# Altium project general-schematics.PrjPCB (part 1 of 2)
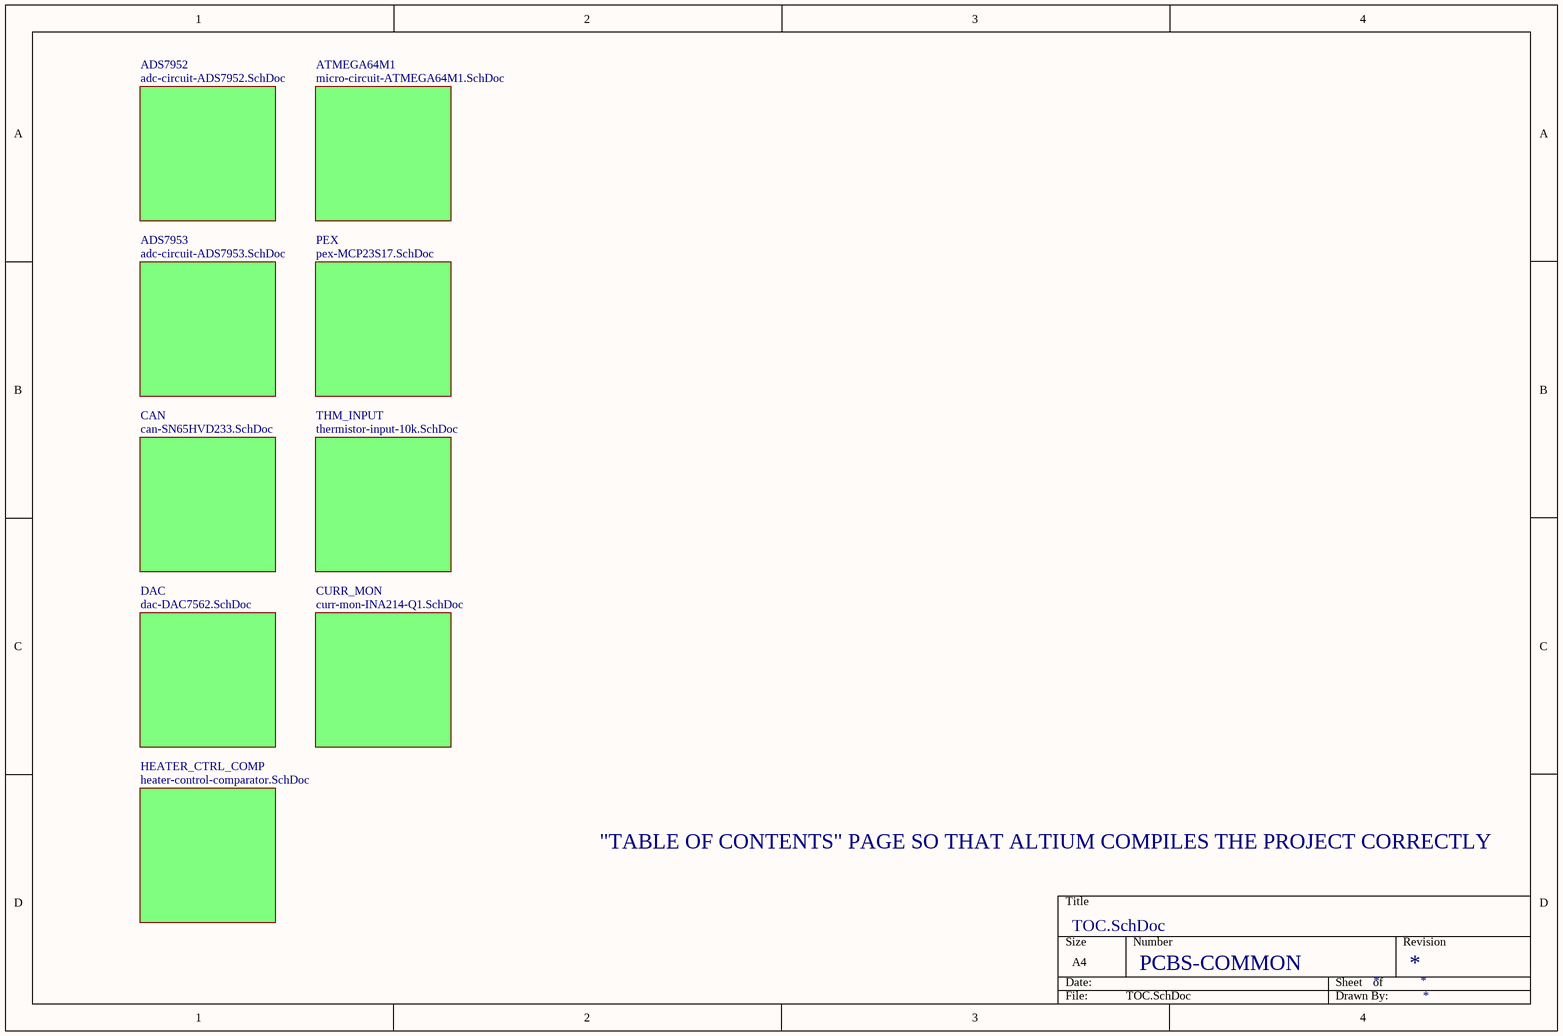
[diagram p0: TOC.SchDoc]
14 sheets, 103 parts. Net scope: hierarchical (ports join the sheet entries above them; power ports are global).
Sheets:
  TOC.SchDoc
    ADS7952 = adc-circuit-ADS7952.SchDoc
      ADS7952 = adc-ADS7952.SchDoc
    ADS7953 = adc-circuit-ADS7953.SchDoc
      ADS7953 = adc-ADS7953.SchDoc
    CAN = can-SN65HVD233.SchDoc
    DAC = dac-DAC7562.SchDoc
    HEATER_CTRL_COMP = heater-control-comparator.SchDoc
    ATMEGA64M1 = micro-circuit-ATMEGA64M1.SchDoc
      micro-circuit- = led-monitoring-SN74HC365PW.SchDoc
      ATMEGA64M1 = micro-ATMEGA64M1.SchDoc
    PEX = pex-MCP23S17.SchDoc
    THM_INPUT = thermistor-input-10k.SchDoc
    CURR_MON = curr-mon-INA214-Q1.SchDoc

## Sheet TOC.SchDoc
size A4

### Sub-sheets
ADS7952 = adc-circuit-ADS7952.SchDoc: no entries
ADS7953 = adc-circuit-ADS7953.SchDoc: no entries
ATMEGA64M1 = micro-circuit-ATMEGA64M1.SchDoc: no entries
CAN = can-SN65HVD233.SchDoc: no entries
CURR_MON = curr-mon-INA214-Q1.SchDoc: no entries
DAC = dac-DAC7562.SchDoc: no entries
HEATER_CTRL_COMP = heater-control-comparator.SchDoc: no entries
PEX = pex-MCP23S17.SchDoc: no entries
THM_INPUT = thermistor-input-10k.SchDoc: no entries

### Notes on the sheet
- "TABLE OF CONTENTS" PAGE SO THAT ALTIUM COMPILES THE PROJECT CORRECTLY
- PCBS-COMMON

## Sheet adc-circuit-ADS7952.SchDoc: ADS7952 Circuit
size A4; DrawnBy: Dylan Vogel; Organization: UTAT SS; Revision: 1.1
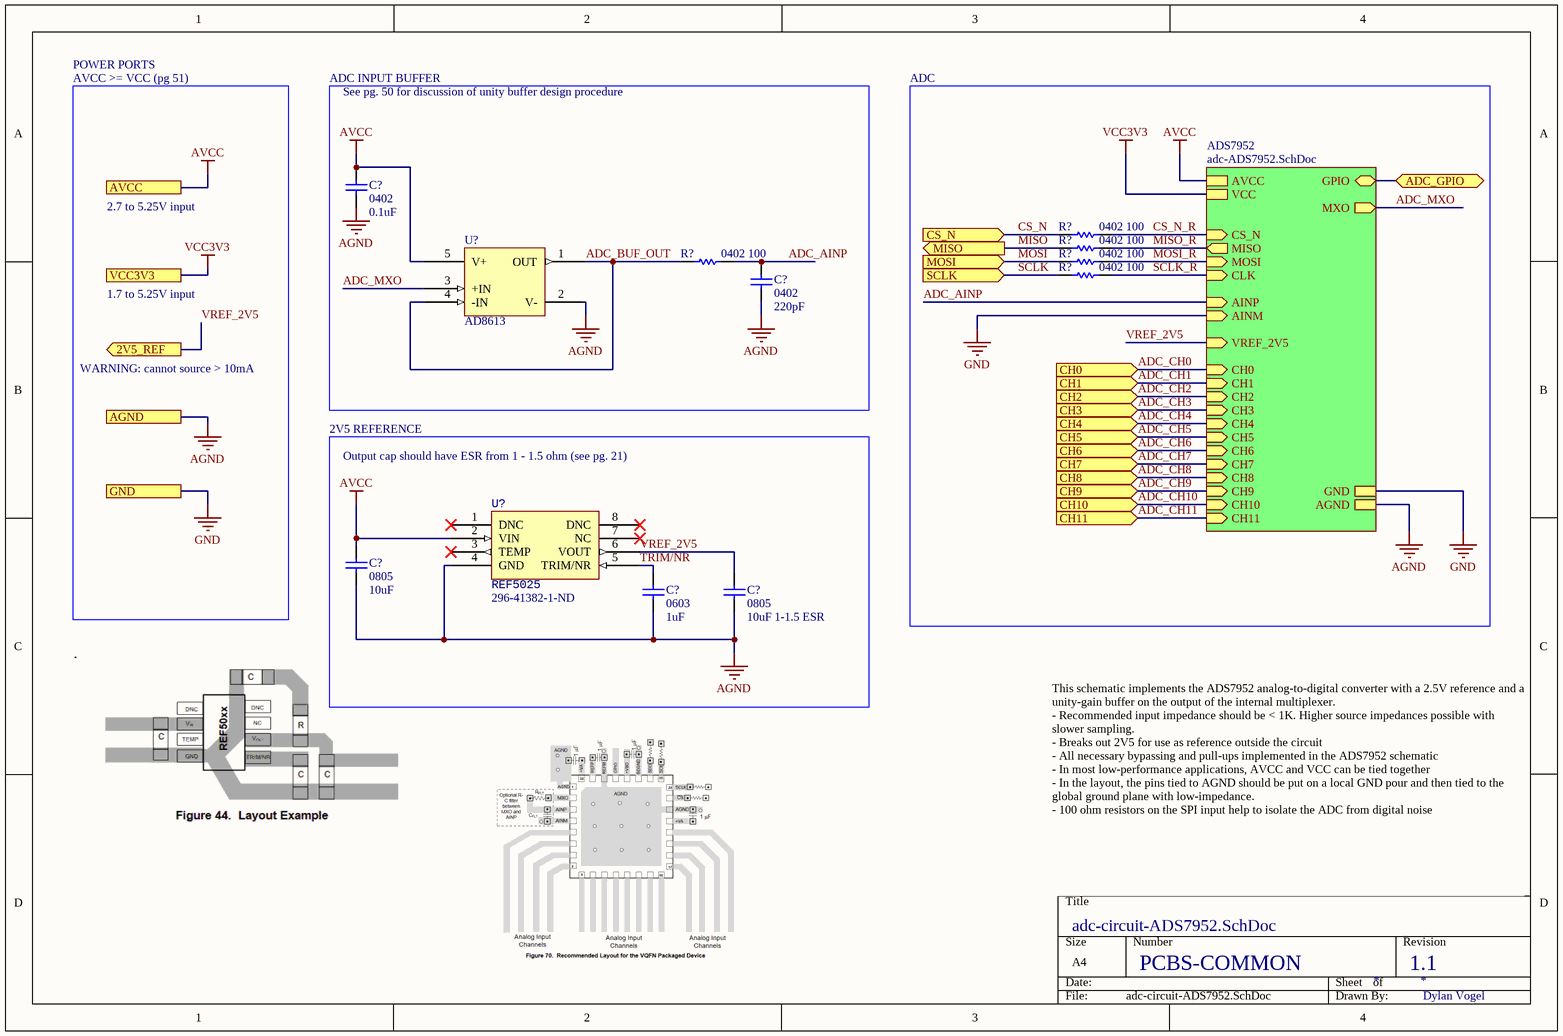
[diagram p1: adc-circuit-ADS7952.SchDoc]

### Parts
(Parts that share a designator on the sheet are numbered #1, #2 ... from top to bottom, then left to right.)
C?#1  0402  value 0.1uF  [CAP0402R]
C?#2  0402  value 220pF  [CAP0402R]
C?#3  0805  value 10uF  [CAP0805R]
C?#4  0603  value 1uF  [CAP0603R]
C?#5  0805  value 10uF 1-1.5 ESR  [CAP0805R]
R?#1  0402  value 100  [RES0402R]
R?#2  0402  value 100  [RES0402R]
R?#3  0402  value 100  [RES0402R]
R?#4  0402  value 100  [RES0402R]
R?#5  0402  value 100  [RES0402R]
U?#1  AD8613  [SOP65P200X125-5N]
U?#2  REF5025  Supplier Part Number 1: 296-41382-1-ND  [SOP65P300X125-8N]

### Blocks framed on the sheet
ADC: R?#1 R?#2 R?#4 R?#5

### Sub-sheets
ADS7952 = adc-ADS7952.SchDoc: CH8 (in), CH2 (in), CH11 (in), CH10 (in), CH9 (in), CH6 (in), CH3 (in), CH7 (in), CH5 (in), CH4 (in), CH0 (in), CH1 (in), AVCC, GND, VCC, AGND, CLK (in), MISO (out), MOSI (in), CS_N (in), GPIO (bidir), AINP (in), VREF_2V5 (in), MXO (out), AINM (in)  | C1: =C6; C2: =C7; C3: =C8; C4: =C9; R1: =R6

### Ports
2V5_REF (out), ADC_GPIO (bidir), AGND, AVCC, CH0 (in), CH1 (in), CH2 (in), CH3 (in), CH4 (in), CH5 (in), CH6 (in), CH7 (in), CH8 (in), CH9 (in), CH10 (in), CH11 (in), CS_N (in), GND, MISO (out), MOSI (in), SCLK (in), VCC3V3

### Nets
AGND: C?#1.1 C?#2.1 C?#3.1 C?#4.1 C?#5.1 U?#1.2(V-) U?#2.4(GND) ; port AGND, sheet ADS7952/AGND
AVCC: C?#1.2 C?#3.2 U?#1.5(V+) U?#2.2(VIN) ; port AVCC, sheet ADS7952/AVCC
GND: port GND, sheet ADS7952/GND, sheet ADS7952/AINM
VCC3V3: port VCC3V3, sheet ADS7952/VCC  [project net VCC]
ADC_AINP: C?#2.2 R?#3.2 ; sheet ADS7952/AINP
ADC_BUF_OUT: R?#3.1 U?#1.1(OUT) U?#1.4(-IN)
ADC_CH0: port CH0, sheet ADS7952/CH0
ADC_CH1: port CH1, sheet ADS7952/CH1
ADC_CH2: port CH2, sheet ADS7952/CH2
ADC_CH3: port CH3, sheet ADS7952/CH3
ADC_CH4: port CH4, sheet ADS7952/CH4
ADC_CH5: port CH5, sheet ADS7952/CH5
ADC_CH6: port CH6, sheet ADS7952/CH6
ADC_CH7: port CH7, sheet ADS7952/CH7
ADC_CH8: port CH8, sheet ADS7952/CH8
ADC_CH9: port CH9, sheet ADS7952/CH9
ADC_CH10: port CH10, sheet ADS7952/CH10
ADC_CH11: port CH11, sheet ADS7952/CH11
ADC_MXO: U?#1.3(+IN) ; sheet ADS7952/MXO
CS_N: R?#1.1 ; port CS_N
CS_N_R: R?#1.2 ; sheet ADS7952/CS_N
GPIO: port ADC_GPIO, sheet ADS7952/GPIO
MISO: R?#2.1 ; port MISO
MISO_R: R?#2.2 ; sheet ADS7952/MISO
MOSI: R?#4.1 ; port MOSI
MOSI_R: R?#4.2 ; sheet ADS7952/MOSI
SCLK: R?#5.1 ; port SCLK
SCLK_R: R?#5.2 ; sheet ADS7952/CLK
TRIM/NR: C?#4.2 U?#2.5(TRIM/NR)
VREF_2V5: C?#5.2 U?#2.6(VOUT) ; port 2V5_REF, sheet ADS7952/VREF_2V5

Not connected (* = marked no-connect by the designer): U?#2 1(DNC)* 3(TEMP)* 7(NC)* 8(DNC)*

### Notes on the sheet
- POWER PORTS
- AVCC >= VCC (pg 51)
- ADC INPUT BUFFER
- See pg. 50 for discussion of unity buffer design procedure
- 2.7 to 5.25V input
- 1.7 to 5.25V input
- WARNING: cannot source > 10mA
- 2V5 REFERENCE
- Output cap should have ESR from 1 - 1.5 ohm (see pg. 21)
- This schematic implements the ADS7952 analog-to-digital converter with a 2.5V reference and a unity-gain buffer on the output of the internal multiplexer.
  - Recommended input impedance should be < 1K. Higher source impedances possible with slower sampling.
  - Breaks out 2V5 for use as reference outside the circuit
  - All necessary bypassing and pull-ups implemented in the ADS7952 schematic
  - In most low-performance applications, AVCC and VCC can be tied together
  - In the layout, the pins tied to AGND should be put on a local GND pour and then tied to the global ground plane with low-impedance.
  - 100 ohm resistors on the SPI input help to isolate the ADC from digital noise
- PCBS-COMMON

### Library data of the parts
C?#1 = CAP0402: 0402 capacitor; Manufacturer: Taiyo Yuden; Manufacturer Part Number: EMK105B7104KVHF; Voltage Rating: 16V; Capacitance: 100nF; Tolerance: 10%; Dielectric: X7R; Supplier 1: Digi-Key; Supplier Part Number 1: 587-3807-1-ND; Stock 1: 18196; Pricing 1: 1=0.1, 10=0.057, 100=0.0254, 500=0.01812, 1000=0.01423, 2500=0.01294, 5000=0.0119 (USD); Mount: Surface Mount; Case/Package: 0402; Weight: 2.3E-05oz; Case Code (Metric): 1005; Case Code (Imperial): 0402; Min Operating Temperature: -55°C; Max Operating Temperature: 125°C; Package Quantity: 10000; Packaging: Tape and Reel; Termination: SMD/SMT; Voltage Rating (DC): 16V; Length: 0.039inch; Height: 0.5mm; Width: 0.02inch; Thickness: 0.022inch; Ratings: AEC-Q200; Lead Free: Lead Free; Halogen Free: Halogen Free
C?#2 = CAP0402: 0402 capacitor; Manufacturer: Murata; Manufacturer Part Number: GCM155R71H221KA37D; Tolerance: 10%; Voltage Rating: 50V; Dielectric: X7R; Supplier 1: Digi-Key; Supplier Part Number 1: 490-4912-1-ND; Stock 1: 141569; Pricing 1: 1=0.1, 10=0.059, 100=0.0264, 500=0.01884, 1000=0.0148, 2500=0.01346, 5000=0.01238 (USD); Mount: Surface Mount; Case/Package: 0402; Case Code (Imperial): 0402; Case Code (Metric): 1005; Min Operating Temperature: -55°C; Max Operating Temperature: 125°C; Capacitance: 220pF; Package Quantity: 1; Packaging: Tape and Reel; Termination: SMD/SMT; Voltage: 50V; Voltage Rating (DC): 50V; Length: 1mm; Height: 0.5mm; Width: 0.02inch; Thickness: 0.022inch; Depth: 0.5mm; Ratings: AEC-Q200; Radiation Hardening: No; ComponentLink1URL: http://psearch.murata.com/capacitor/product/GCM155R71H221KA37%23.pdf?src-supplier=Avnet+Europe; ComponentLink1Description: http://psearch.murata.com/capacitor/product/GCM155R71H221KA37%23.pdf?src-supplier=Avnet+Europe; ComponentLink2URL: http://search.murata.co.jp/Ceramy/image/img/A01X/partnumbering_e_02.pdf?src-supplier=Digi-Key; ComponentLink2Description: http://search.murata.co.jp/Ceramy/image/img/A01X/partnumbering_e_02.pdf?src-supplier=Digi-Key; ComponentLink3URL: https://www.murata.com/~/media/webrenewal/support/library/catalog/products/capacitor/mlcc/c03e.ashx?src-supplier=Avnet; ComponentLink3Description: https://www.murata.com/~/media/webrenewal/support/library/catalog/products/capacitor/mlcc/c03e.ashx?src-supplier=Avnet
C?#3 = CAP0805: 0805 capacitor; Manufacturer: Murata; Manufacturer Part Number: GCM21BR70J106KE22K; Tolerance: 10%; Dielectric: X7R; Voltage Rating (DC): 6.3V; Supplier 1: Digi-Key; Supplier Part Number 1: 490-14361-1-ND; Stock 1: 214938; Pricing 1: 1=0.42, 10=0.29, 100=0.1742, 500=0.13064, 1000=0.11031, 2500=0.10451, 5000=0.0987 (USD); Case/Package: 0805; Min Operating Temperature: -55°C; Max Operating Temperature: 125°C; Capacitance: 10uF; Packaging: Tape and Reel; Length: 2mm; Depth: 1.25mm; Lead Free: Lead Free
C?#4 = CAP0603: 0603 capacitor; Manufacturer: KEMET; Manufacturer Part Number: C0603C105K4RACAUTO; Tolerance: 10%; Voltage Rating: 16V; Supplier 1: Digi-Key; Supplier Part Number 1: 399-17704-1-ND; Stock 1: 376276; Pricing 1: 1=0.17, 10=0.12, 100=0.0564, 500=0.03952, 1000=0.03273 (USD); Mount: Surface Mount; Case/Package: 0603; Case Code (Imperial): 0603; Case Code (Metric): 1608; Min Operating Temperature: -55°C; Max Operating Temperature: 125°C; Packaging: Cut Tape; Capacitance: 1uF; Ratings: AEC-Q200
C?#5 = CAP0805: 0805 capacitor; Manufacturer: Murata; Manufacturer Part Number: GCM21BR70J106KE22K; Capacitance: 10uF; Tolerance: 10%; Dielectric: X7R; Voltage Rating (DC): 6.3V; Supplier 1: Digi-Key; Supplier Part Number 1: 490-14361-1-ND; Stock 1: 214938; Pricing 1: 1=0.42, 10=0.29, 100=0.1742, 500=0.13064, 1000=0.11031, 2500=0.10451, 5000=0.0987 (USD); Case/Package: 0805; Min Operating Temperature: -55°C; Max Operating Temperature: 125°C; Packaging: Tape and Reel; Length: 2mm; Depth: 1.25mm; Lead Free: Lead Free
R?#1-R?#5 = RES0402: 0402 resistor; Manufacturer: Vishay Dale; Manufacturer Part Number: CRCW0402100RFKEDHP; Resistance: 100R; Tolerance: 1%; Power Rating: 125mW; Voltage Rating: 50V; Temperature Coefficient: 100ppm/°C; Supplier 1: Digi-Key; Supplier Part Number 1: 541-100YCT-ND; Stock 1: 530594; Pricing 1: 1=0.15, 10=0.138, 100=0.0532, 1000=0.02343, 2500=0.02023, 5000=0.0181 (USD); Mount: Surface Mount; Case/Package: 0402; Weight: 2.3E-05oz; Case Code (Imperial): 0402; Case Code (Metric): 1005; Contact Plating: Tin; Min Operating Temperature: -55°C; Max Operating Temperature: 155°C; Packaging: Tape and Reel; Package Quantity: 10000; Termination: SMD/SMT; Composition: Thick Film; Voltage Rating (DC): 50V; Length: 1mm; Height: 0.3mm; Width: 0.5mm; Depth: 0.5mm; Radiation Hardening: No; REACH SVHC: Unknown; Lead Free: Lead Free; ComponentLink1URL: http://www.vishay.com/docs/20043/crcwhpe3.pdf?src-supplier=Avnet; ComponentLink1Description: http://www.vishay.com/docs/20043/crcwhpe3.pdf?src-supplier=Avnet
U?#1 = AD8613: Low power, low noise rail-to-rail op-amp.; Supplier 1: Digi-Key; Supplier Part Number 1: AD8613AKSZ-REEL7CT-ND
U?#2 = REF5025: Voltage Reference; Supplier 1: Digi-Key

## Sheet adc-ADS7952.SchDoc: ADS7952
size A4; DrawnBy: Dylan Vogel; Organization: UTAT SS; Revision: 1.1
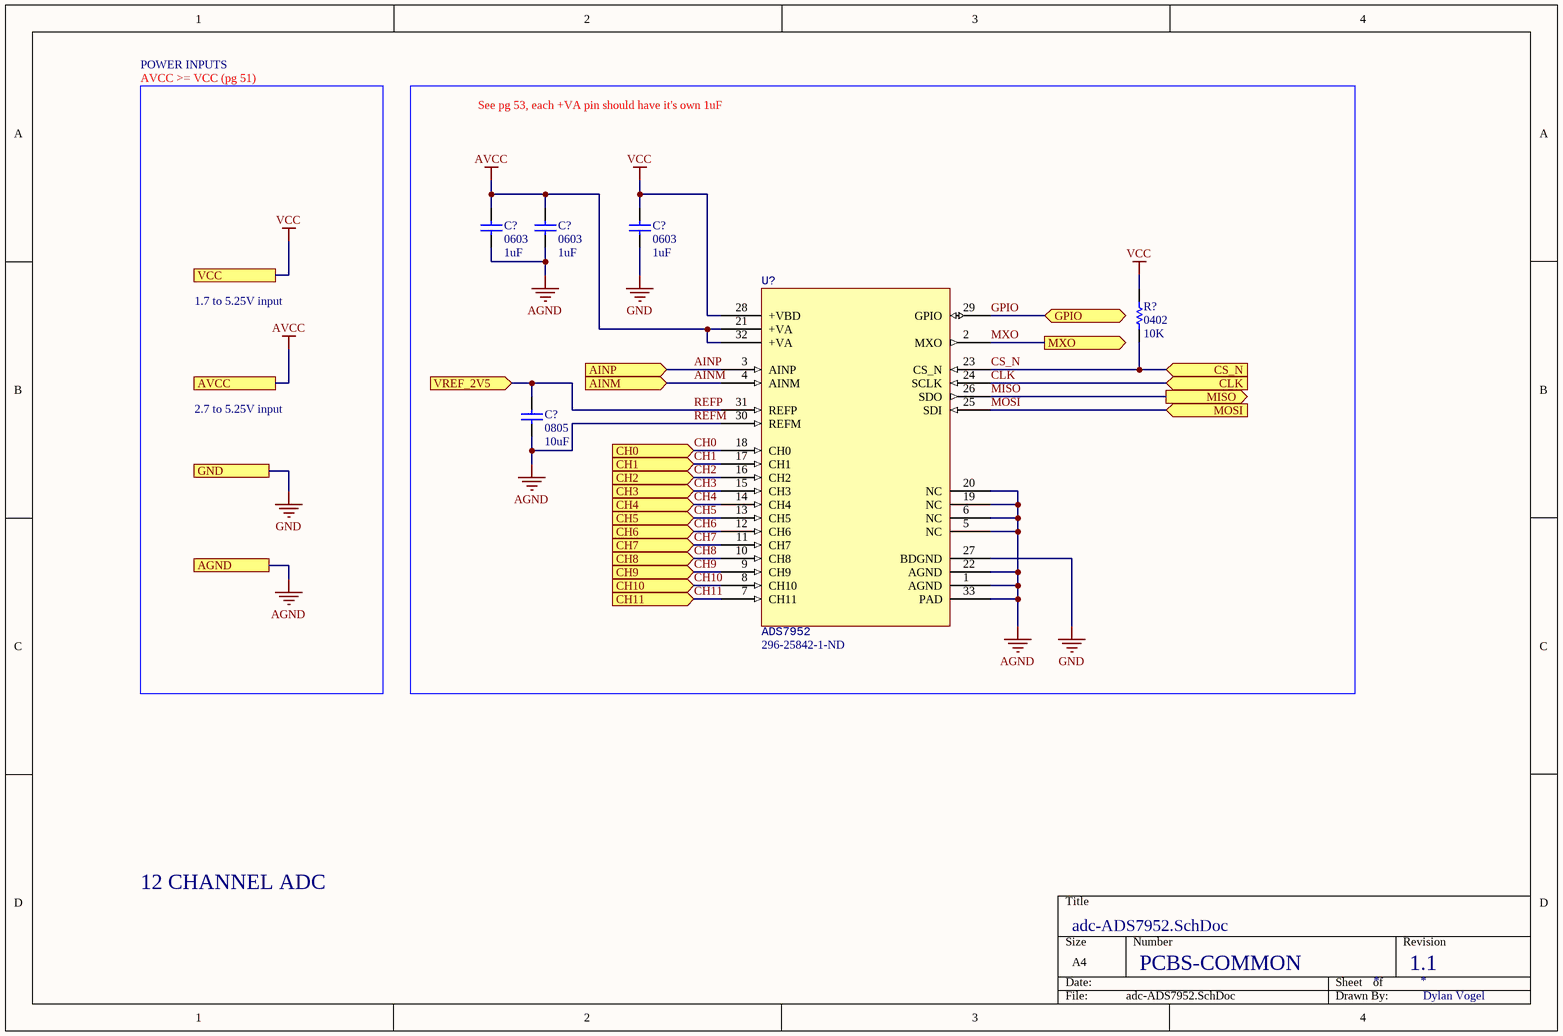
[diagram p2: adc-ADS7952.SchDoc]

### Parts
(Parts that share a designator on the sheet are numbered #1, #2 ... from top to bottom, then left to right.)
C?#6  0603  value 1uF  [CAP0603R]
C?#7  0603  value 1uF  [CAP0603R]
C?#8  0603  value 1uF  [CAP0603R]
C?#9  0805  value 10uF  [CAP0805R]
R?#6  0402  value 10K  [RES0402R]
U?#3  ADS7952  Supplier Part Number 1: 296-25842-1-ND  [QFN50P500X500X100-33]

### Blocks framed on the sheet
See pg 53, each +VA pin should have it's own 1uF: C?#6-C?#9 R?#6 U?#3

### Ports
AGND, AINM (in), AINP (in), AVCC, CH0 (in), CH1 (in), CH2 (in), CH3 (in), CH4 (in), CH5 (in), CH6 (in), CH7 (in), CH8 (in), CH9 (in), CH10 (in), CH11 (in), CLK (in), CS_N (in), GND, GPIO (bidir), MISO (out), MOSI (in), MXO (out), VCC, VREF_2V5 (in)

### Nets
AGND: C?#6.1 C?#7.1 C?#9.1 U?#3.1(AGND) U?#3.5(NC) U?#3.6(NC) U?#3.19(NC) U?#3.20(NC) U?#3.22(AGND) U?#3.30(REFM) U?#3.33(PAD) ; port AGND  [also labelled REFM]
AVCC: C?#6.2 C?#7.2 U?#3.21(+VA) U?#3.32(+VA) ; port AVCC
GND: C?#8.1 U?#3.4(AINM) U?#3.27(BDGND) ; port GND, port AINM  [also labelled AINM]
VCC: C?#8.2 R?#6.2 U?#3.28(+VBD) ; port VCC
AINP: U?#3.3(AINP) ; port AINP  [project net ADC_AINP]
CH0: U?#3.18(CH0) ; port CH0  [project net ADC_CH0]
CH1: U?#3.17(CH1) ; port CH1  [project net ADC_CH1]
CH2: U?#3.16(CH2) ; port CH2  [project net ADC_CH2]
CH3: U?#3.15(CH3) ; port CH3  [project net ADC_CH3]
CH4: U?#3.14(CH4) ; port CH4  [project net ADC_CH4]
CH5: U?#3.13(CH5) ; port CH5  [project net ADC_CH5]
CH6: U?#3.12(CH6) ; port CH6  [project net ADC_CH6]
CH7: U?#3.11(CH7) ; port CH7  [project net ADC_CH7]
CH8: U?#3.10(CH8) ; port CH8  [project net ADC_CH8]
CH9: U?#3.9(CH9) ; port CH9  [project net ADC_CH9]
CH10: U?#3.8(CH10) ; port CH10  [project net ADC_CH10]
CH11: U?#3.7(CH11) ; port CH11  [project net ADC_CH11]
CLK: U?#3.24(SCLK) ; port CLK  [project net SCLK_R]
CS_N: R?#6.1 U?#3.23(CS_N) ; port CS_N  [project net CS_N_R]
GPIO: U?#3.29(GPIO) ; port GPIO
MISO: U?#3.26(SDO) ; port MISO  [project net MISO_R]
MOSI: U?#3.25(SDI) ; port MOSI  [project net MOSI_R]
MXO: U?#3.2(MXO) ; port MXO  [project net ADC_MXO]
REFP: C?#9.2 U?#3.31(REFP) ; port VREF_2V5  [project net VREF_2V5]

### Notes on the sheet
- POWER INPUTS
- AVCC >= VCC (pg 51)
- 1.7 to 5.25V input
- 2.7 to 5.25V input
- 12 CHANNEL ADC
- PCBS-COMMON

### Library data of the parts
C?#6-C?#8 = CAP0603: 0603 capacitor; Manufacturer: KEMET; Manufacturer Part Number: C0603C105K4RACAUTO; Description: CAP CER 0603 1UF 16V X7R 10%; Tolerance: 10%; Voltage Rating: 16V; Supplier 1: Digi-Key; Supplier Part Number 1: 399-17704-1-ND; Stock 1: 376276; Pricing 1: 1=0.17, 10=0.12, 100=0.0564, 500=0.03952, 1000=0.03273 (USD); Mount: Surface Mount; Case/Package: 0603; Case Code (Imperial): 0603; Case Code (Metric): 1608; Min Operating Temperature: -55°C; Max Operating Temperature: 125°C; Packaging: Cut Tape; Capacitance: 1uF; Ratings: AEC-Q200
C?#9 = CAP0805: 0805 capacitor; Manufacturer: Murata; Manufacturer Part Number: GCM21BR70J106KE22K; Description: Cap Ceramic 10uF 6.3V X7R 10% SMD 0805 125C Embossed T/R; Tolerance: 10%; Dielectric: X7R; Voltage Rating (DC): 6.3V; Supplier 1: Digi-Key; Supplier Part Number 1: 490-14361-1-ND; Stock 1: 214938; Pricing 1: 1=0.42, 10=0.29, 100=0.1742, 500=0.13064, 1000=0.11031, 2500=0.10451, 5000=0.0987 (USD); Case/Package: 0805; Min Operating Temperature: -55°C; Max Operating Temperature: 125°C; Capacitance: 10uF; Packaging: Tape and Reel; Length: 2mm; Depth: 1.25mm; Lead Free: Lead Free
R?#6 = RES0402: 0402 resistor; Manufacturer: Panasonic; Manufacturer Part Number: ERJ-2RKF1002X; Description: RES SMD 10K OHM 1% 1/10W 0402; Resistance: 10kR; Power Rating: 100mW; Tolerance: 1%; Voltage Rating: 50V; Temperature Coefficient: 100ppm/°C; Supplier 1: Digi-Key; Supplier Part Number 1: P10.0KLCT-ND; Stock 1: 14350001; Pricing 1: 1=0.1, 10=0.045, 100=0.0183, 1000=0.00823, 2500=0.00715, 5000=0.0059 (USD); Mount: Surface Mount; Case/Package: 0402; Number of Pins: 2; Case Code (Metric): 1005; Case Code (Imperial): 0402; Contact Plating: Tin; Min Operating Temperature: -55°C; Max Operating Temperature: 155°C; Packaging: Tape and Reel; Package Quantity: 1; Composition: Thick Film; Number of Terminations: 2; Termination: SMD/SMT; Military Standard: Not; Max Power Dissipation: 100mW; Voltage Rating (DC): 50V; Features: Automotive AEC-Q200; Length: 1mm; Height: 0.35mm; Width: 0.02inch; Depth: 0.5mm; Radiation Hardening: No; REACH SVHC: No SVHC; Lead Free: Lead Free; ComponentLink1URL: http://industrial.panasonic.com/www-data/pdf/AOA0000/AOA0000CE2.pdf?src-supplier=Future+Electronics; ComponentLink1Description: http://industrial.panasonic.com/www-data/pdf/AOA0000/AOA0000CE2.pdf?src-supplier=Future+Electronics; ComponentLink2URL: http://industrial.panasonic.com/www-data/pdf/AOA0000/AOA0000CE2.pdf?src-supplier=Avnet+Europe; ComponentLink2Description: http://industrial.panasonic.com/www-data/pdf/AOA0000/AOA0000CE2.pdf?src-supplier=Avnet+Europe; ComponentLink3URL: https://industrial.panasonic.com/cdbs/www-data/pdf/RDA0000/DMA0000COL11.pdf?src-supplier=Mouser; ComponentLink3Description: https://industrial.panasonic.com/cdbs/www-data/pdf/RDA0000/DMA0000COL11.pdf?src-supplier=Mouser; ComponentLink4URL: http://www.farnell.com/datasheets/1678782.pdf?src-supplier=Element14; ComponentLink4Description: http://www.farnell.com/datasheets/1678782.pdf?src-supplier=Element14; ComponentLink5URL: http://www.farnell.com/datasheets/1911175.pdf?src-supplier=Farnell; ComponentLink5Description: http://www.farnell.com/datasheets/1911175.pdf?src-supplier=Farnell; ComponentLink6URL: http://www.jameco.com/Jameco/Products/ProdDS/1987020.pdf?src-supplier=Jameco; ComponentLink6Description: http://www.jameco.com/Jameco/Products/ProdDS/1987020.pdf?src-supplier=Jameco; ComponentLink7URL: http://industrial.panasonic.com/www-data/pdf/AOA0000/AOA0000CE2.pdf?src-supplier=Avnet; ComponentLink7Description: http://industrial.panasonic.com/www-data/pdf/AOA0000/AOA0000CE2.pdf?src-supplier=Avnet; ComponentLink8URL: http://www.alliedelec.com/m/d/623f45ff1957d936ff56d46fd1c28cac.pdf?src-supplier=Allied+Electronics; ComponentLink8Description: http://www.alliedelec.com/m/d/623f45ff1957d936ff56d46fd1c28cac.pdf?src-supplier=Allied+Electronics
U?#3 = ADS7952: 12 bit, 12 channel analog-to-digital converter with SPI interface.; Supplier 1: Digi-Key

## Sheet adc-circuit-ADS7953.SchDoc
size A4; DrawnBy: Dylan Vogel; Revision: 1.1
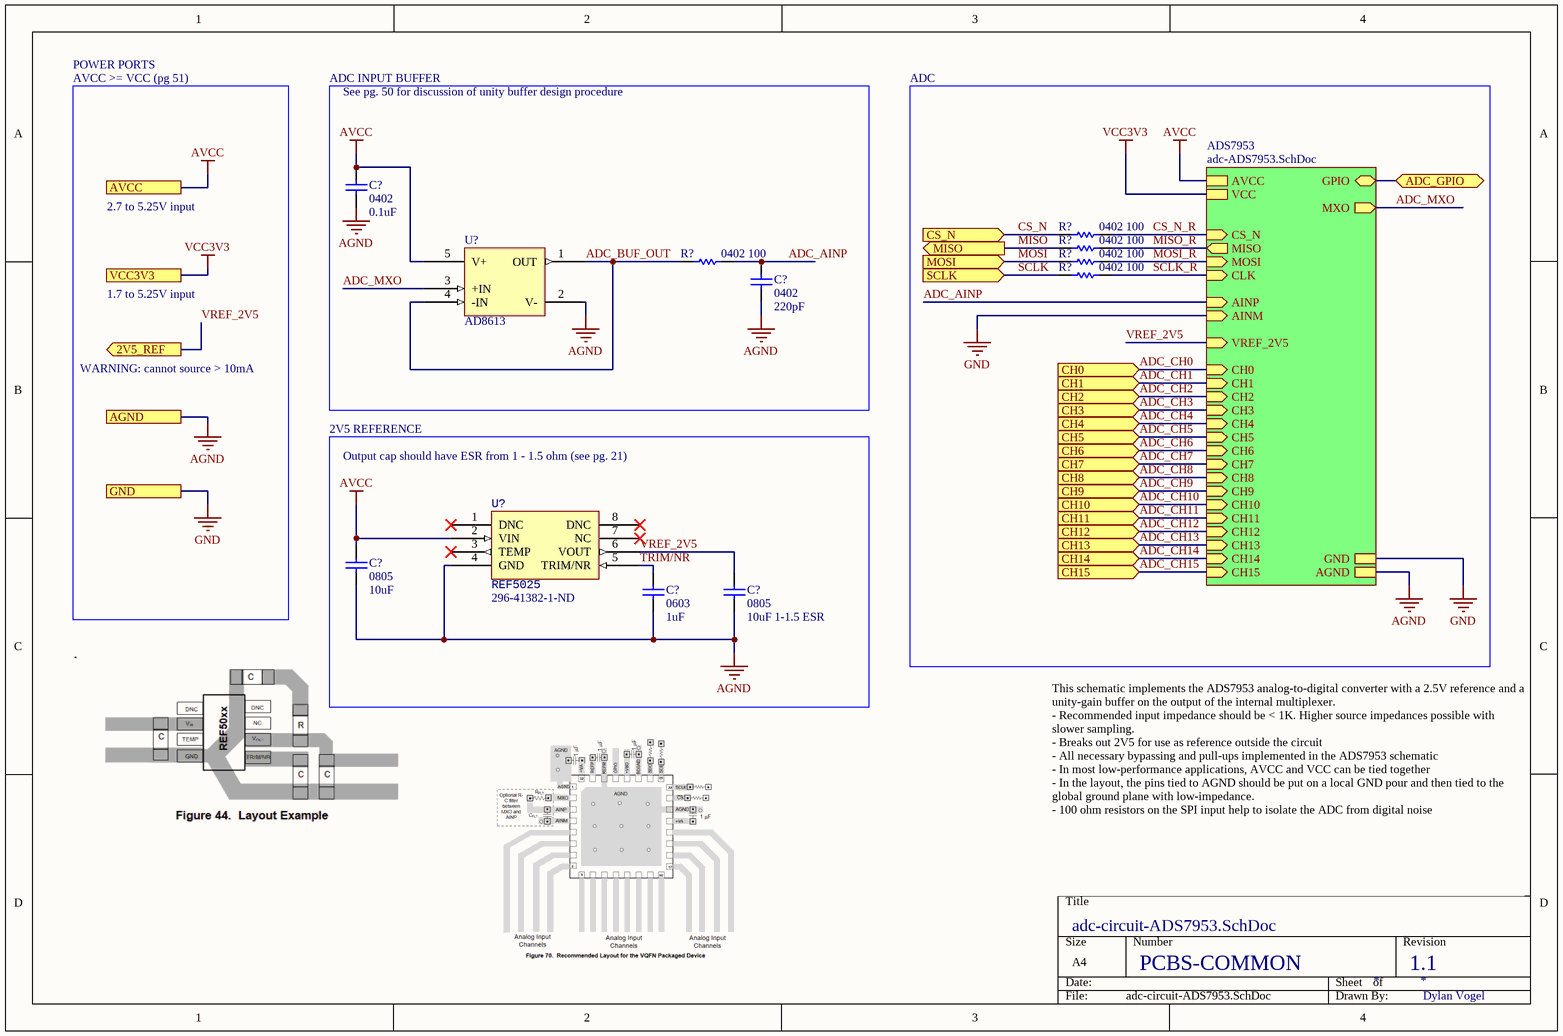
[diagram p3: adc-circuit-ADS7953.SchDoc]

### Parts
(Parts that share a designator on the sheet are numbered #1, #2 ... from top to bottom, then left to right.)
C?#10  0402  value 0.1uF  [CAP0402R]
C?#11  0402  value 220pF  [CAP0402R]
C?#12  0805  value 10uF  [CAP0805R]
C?#13  0603  value 1uF  [CAP0603R]
C?#14  0805  value 10uF 1-1.5 ESR  [CAP0805R]
R?#7  0402  value 100  [RES0402R]
R?#8  0402  value 100  [RES0402R]
R?#9  0402  value 100  [RES0402R]
R?#10  0402  value 100  [RES0402R]
R?#11  0402  value 100  [RES0402R]
U?#4  AD8613  [SOP65P200X125-5N]
U?#5  REF5025  Supplier Part Number 1: 296-41382-1-ND  [SOP65P300X125-8N]

### Blocks framed on the sheet
ADC: R?#7 R?#8 R?#10 R?#11

### Sub-sheets
ADS7953 = adc-ADS7953.SchDoc: CH8 (in), CH2 (in), CH11 (in), CH10 (in), CH9 (in), CH6 (in), CH3 (in), CH7 (in), CH5 (in), CH4 (in), CH0 (in), CH1 (in), AVCC, GND, VCC, AGND, CLK (in), MISO (out), MOSI (in), CS_N (in), GPIO (bidir), AINP (in), VREF_2V5 (in), MXO (out), AINM (in), CH15 (in), CH14 (in), CH13 (in), CH12 (in)  | C1: =C6; C2: =C7; C3: =C8; C4: =C9; R1: =R6

### Ports
2V5_REF (out), ADC_GPIO (bidir), AGND, AVCC, CH0 (in), CH1 (in), CH2 (in), CH3 (in), CH4 (in), CH5 (in), CH6 (in), CH7 (in), CH8 (in), CH9 (in), CH10 (in), CH11 (in), CH12 (in), CH13 (in), CH14 (in), CH15 (in), CS_N (in), GND, MISO (out), MOSI (in), SCLK (in), VCC3V3

### Nets
AGND: C?#10.1 C?#11.1 C?#12.1 C?#13.1 C?#14.1 U?#4.2(V-) U?#5.4(GND) ; port AGND, sheet ADS7953/AGND
AVCC: C?#10.2 C?#12.2 U?#4.5(V+) U?#5.2(VIN) ; port AVCC, sheet ADS7953/AVCC
GND: port GND, sheet ADS7953/GND, sheet ADS7953/AINM
VCC3V3: port VCC3V3, sheet ADS7953/VCC  [project net VCC]
ADC_AINP: C?#11.2 R?#9.2 ; sheet ADS7953/AINP
ADC_BUF_OUT: R?#9.1 U?#4.1(OUT) U?#4.4(-IN)
ADC_CH0: port CH0, sheet ADS7953/CH0
ADC_CH1: port CH1, sheet ADS7953/CH1
ADC_CH2: port CH2, sheet ADS7953/CH2
ADC_CH3: port CH3, sheet ADS7953/CH3
ADC_CH4: port CH4, sheet ADS7953/CH4
ADC_CH5: port CH5, sheet ADS7953/CH5
ADC_CH6: port CH6, sheet ADS7953/CH6
ADC_CH7: port CH7, sheet ADS7953/CH7
ADC_CH8: port CH8, sheet ADS7953/CH8
ADC_CH9: port CH9, sheet ADS7953/CH9
ADC_CH10: port CH10, sheet ADS7953/CH10
ADC_CH11: port CH11, sheet ADS7953/CH11
ADC_CH12: port CH12, sheet ADS7953/CH12
ADC_CH13: port CH13, sheet ADS7953/CH13
ADC_CH14: port CH14, sheet ADS7953/CH14
ADC_CH15: port CH15, sheet ADS7953/CH15
ADC_MXO: U?#4.3(+IN) ; sheet ADS7953/MXO
CS_N: R?#7.1 ; port CS_N
CS_N_R: R?#7.2 ; sheet ADS7953/CS_N
GPIO: port ADC_GPIO, sheet ADS7953/GPIO
MISO: R?#8.1 ; port MISO
MISO_R: R?#8.2 ; sheet ADS7953/MISO
MOSI: R?#10.1 ; port MOSI
MOSI_R: R?#10.2 ; sheet ADS7953/MOSI
SCLK: R?#11.1 ; port SCLK
SCLK_R: R?#11.2 ; sheet ADS7953/CLK
TRIM/NR: C?#13.2 U?#5.5(TRIM/NR)
VREF_2V5: C?#14.2 U?#5.6(VOUT) ; port 2V5_REF, sheet ADS7953/VREF_2V5

Not connected (* = marked no-connect by the designer): U?#5 1(DNC)* 3(TEMP)* 7(NC)* 8(DNC)*

### Notes on the sheet
- POWER PORTS
- AVCC >= VCC (pg 51)
- ADC INPUT BUFFER
- See pg. 50 for discussion of unity buffer design procedure
- 2.7 to 5.25V input
- 1.7 to 5.25V input
- WARNING: cannot source > 10mA
- 2V5 REFERENCE
- Output cap should have ESR from 1 - 1.5 ohm (see pg. 21)
- This schematic implements the ADS7953 analog-to-digital converter with a 2.5V reference and a unity-gain buffer on the output of the internal multiplexer.
  - Recommended input impedance should be < 1K. Higher source impedances possible with slower sampling.
  - Breaks out 2V5 for use as reference outside the circuit
  - All necessary bypassing and pull-ups implemented in the ADS7953 schematic
  - In most low-performance applications, AVCC and VCC can be tied together
  - In the layout, the pins tied to AGND should be put on a local GND pour and then tied to the global ground plane with low-impedance.
  - 100 ohm resistors on the SPI input help to isolate the ADC from digital noise
- PCBS-COMMON

### Library data of the parts
C?#10 = CAP0402: 0402 capacitor; Manufacturer: Taiyo Yuden; Manufacturer Part Number: EMK105B7104KVHF; Description: Multilayer Ceramic Capacitors MLCC - SMD/SMT 0.1uF 16V X7R +/-10% 0402 AEC-Q200; Voltage Rating: 16V; Capacitance: 100nF; Tolerance: 10%; Dielectric: X7R; Supplier 1: Digi-Key; Supplier Part Number 1: 587-3807-1-ND; Stock 1: 18196; Pricing 1: 1=0.1, 10=0.057, 100=0.0254, 500=0.01812, 1000=0.01423, 2500=0.01294, 5000=0.0119 (USD); Mount: Surface Mount; Case/Package: 0402; Weight: 2.3E-05oz; Case Code (Metric): 1005; Case Code (Imperial): 0402; Min Operating Temperature: -55°C; Max Operating Temperature: 125°C; Package Quantity: 10000; Packaging: Tape and Reel; Termination: SMD/SMT; Voltage Rating (DC): 16V; Length: 0.039inch; Height: 0.5mm; Width: 0.02inch; Thickness: 0.022inch; Ratings: AEC-Q200; Lead Free: Lead Free; Halogen Free: Halogen Free
C?#11 = CAP0402: 0402 capacitor; Manufacturer: Murata; Manufacturer Part Number: GCM155R71H221KA37D; Description: CAP CER 220PF 50V X7R 0402; Tolerance: 10%; Voltage Rating: 50V; Dielectric: X7R; Supplier 1: Digi-Key; Supplier Part Number 1: 490-4912-1-ND; Stock 1: 141569; Pricing 1: 1=0.1, 10=0.059, 100=0.0264, 500=0.01884, 1000=0.0148, 2500=0.01346, 5000=0.01238 (USD); Mount: Surface Mount; Case/Package: 0402; Case Code (Imperial): 0402; Case Code (Metric): 1005; Min Operating Temperature: -55°C; Max Operating Temperature: 125°C; Capacitance: 220pF; Package Quantity: 1; Packaging: Tape and Reel; Termination: SMD/SMT; Voltage: 50V; Voltage Rating (DC): 50V; Length: 1mm; Height: 0.5mm; Width: 0.02inch; Thickness: 0.022inch; Depth: 0.5mm; Ratings: AEC-Q200; Radiation Hardening: No; ComponentLink1URL: http://psearch.murata.com/capacitor/product/GCM155R71H221KA37%23.pdf?src-supplier=Avnet+Europe; ComponentLink1Description: http://psearch.murata.com/capacitor/product/GCM155R71H221KA37%23.pdf?src-supplier=Avnet+Europe; ComponentLink2URL: http://search.murata.co.jp/Ceramy/image/img/A01X/partnumbering_e_02.pdf?src-supplier=Digi-Key; ComponentLink2Description: http://search.murata.co.jp/Ceramy/image/img/A01X/partnumbering_e_02.pdf?src-supplier=Digi-Key; ComponentLink3URL: https://www.murata.com/~/media/webrenewal/support/library/catalog/products/capacitor/mlcc/c03e.ashx?src-supplier=Avnet; ComponentLink3Description: https://www.murata.com/~/media/webrenewal/support/library/catalog/products/capacitor/mlcc/c03e.ashx?src-supplier=Avnet
C?#12 = CAP0805: as C?#9 on sheet adc-ADS7952; Supplier 1: Digi-Key; Supplier Part Number 1: 490-14361-1-ND; Stock 1: 214938; Pricing 1: 1=0.42, 10=0.29, 100=0.1742, 500=0.13064, 1000=0.11031, 2500=0.10451, 5000=0.0987 (USD); Case/Package: 0805; Min Operating Temperature: -55°C; Max Operating Temperature: 125°C; Capacitance: 10uF; Packaging: Tape and Reel; Length: 2mm; Depth: 1.25mm; Lead Free: Lead Free
C?#13 = CAP0603: as C?#6 on sheet adc-ADS7952; Supplier 1: Digi-Key; Supplier Part Number 1: 399-17704-1-ND; Stock 1: 376276; Pricing 1: 1=0.17, 10=0.12, 100=0.0564, 500=0.03952, 1000=0.03273 (USD); Mount: Surface Mount; Case/Package: 0603; Case Code (Imperial): 0603; Case Code (Metric): 1608; Min Operating Temperature: -55°C; Max Operating Temperature: 125°C; Packaging: Cut Tape; Capacitance: 1uF; Ratings: AEC-Q200
C?#14 = CAP0805: 0805 capacitor; Manufacturer: Murata; Manufacturer Part Number: GCM21BR70J106KE22K; Description: Cap Ceramic 10uF 6.3V X7R 10% SMD 0805 125C Embossed T/R; Capacitance: 10uF; Tolerance: 10%; Dielectric: X7R; Voltage Rating (DC): 6.3V; Supplier 1: Digi-Key; Supplier Part Number 1: 490-14361-1-ND; Stock 1: 214938; Pricing 1: 1=0.42, 10=0.29, 100=0.1742, 500=0.13064, 1000=0.11031, 2500=0.10451, 5000=0.0987 (USD); Case/Package: 0805; Min Operating Temperature: -55°C; Max Operating Temperature: 125°C; Packaging: Tape and Reel; Length: 2mm; Depth: 1.25mm; Lead Free: Lead Free
R?#7-R?#11 = RES0402: 0402 resistor; Manufacturer: Vishay Dale; Manufacturer Part Number: CRCW0402100RFKEDHP; Description: RES SMD 100 OHM 1% 1/5W 0402; Resistance: 100R; Tolerance: 1%; Power Rating: 125mW; Voltage Rating: 50V; Temperature Coefficient: 100ppm/°C; Supplier 1: Digi-Key; Supplier Part Number 1: 541-100YCT-ND; Stock 1: 530594; Pricing 1: 1=0.15, 10=0.138, 100=0.0532, 1000=0.02343, 2500=0.02023, 5000=0.0181 (USD); Mount: Surface Mount; Case/Package: 0402; Weight: 2.3E-05oz; Case Code (Imperial): 0402; Case Code (Metric): 1005; Contact Plating: Tin; Min Operating Temperature: -55°C; Max Operating Temperature: 155°C; Packaging: Tape and Reel; Package Quantity: 10000; Termination: SMD/SMT; Composition: Thick Film; Voltage Rating (DC): 50V; Length: 1mm; Height: 0.3mm; Width: 0.5mm; Depth: 0.5mm; Radiation Hardening: No; REACH SVHC: Unknown; Lead Free: Lead Free; ComponentLink1URL: http://www.vishay.com/docs/20043/crcwhpe3.pdf?src-supplier=Avnet; ComponentLink1Description: http://www.vishay.com/docs/20043/crcwhpe3.pdf?src-supplier=Avnet
U?#4 = AD8613: as U?#1 on sheet adc-circuit-ADS7952; Supplier 1: Digi-Key; Supplier Part Number 1: AD8613AKSZ-REEL7CT-ND
U?#5 = REF5025: Voltage Reference; Supplier 1: Digi-Key

## Sheet adc-ADS7953.SchDoc
size A4; DrawnBy: Dylan Vogel; Revision: 1.1
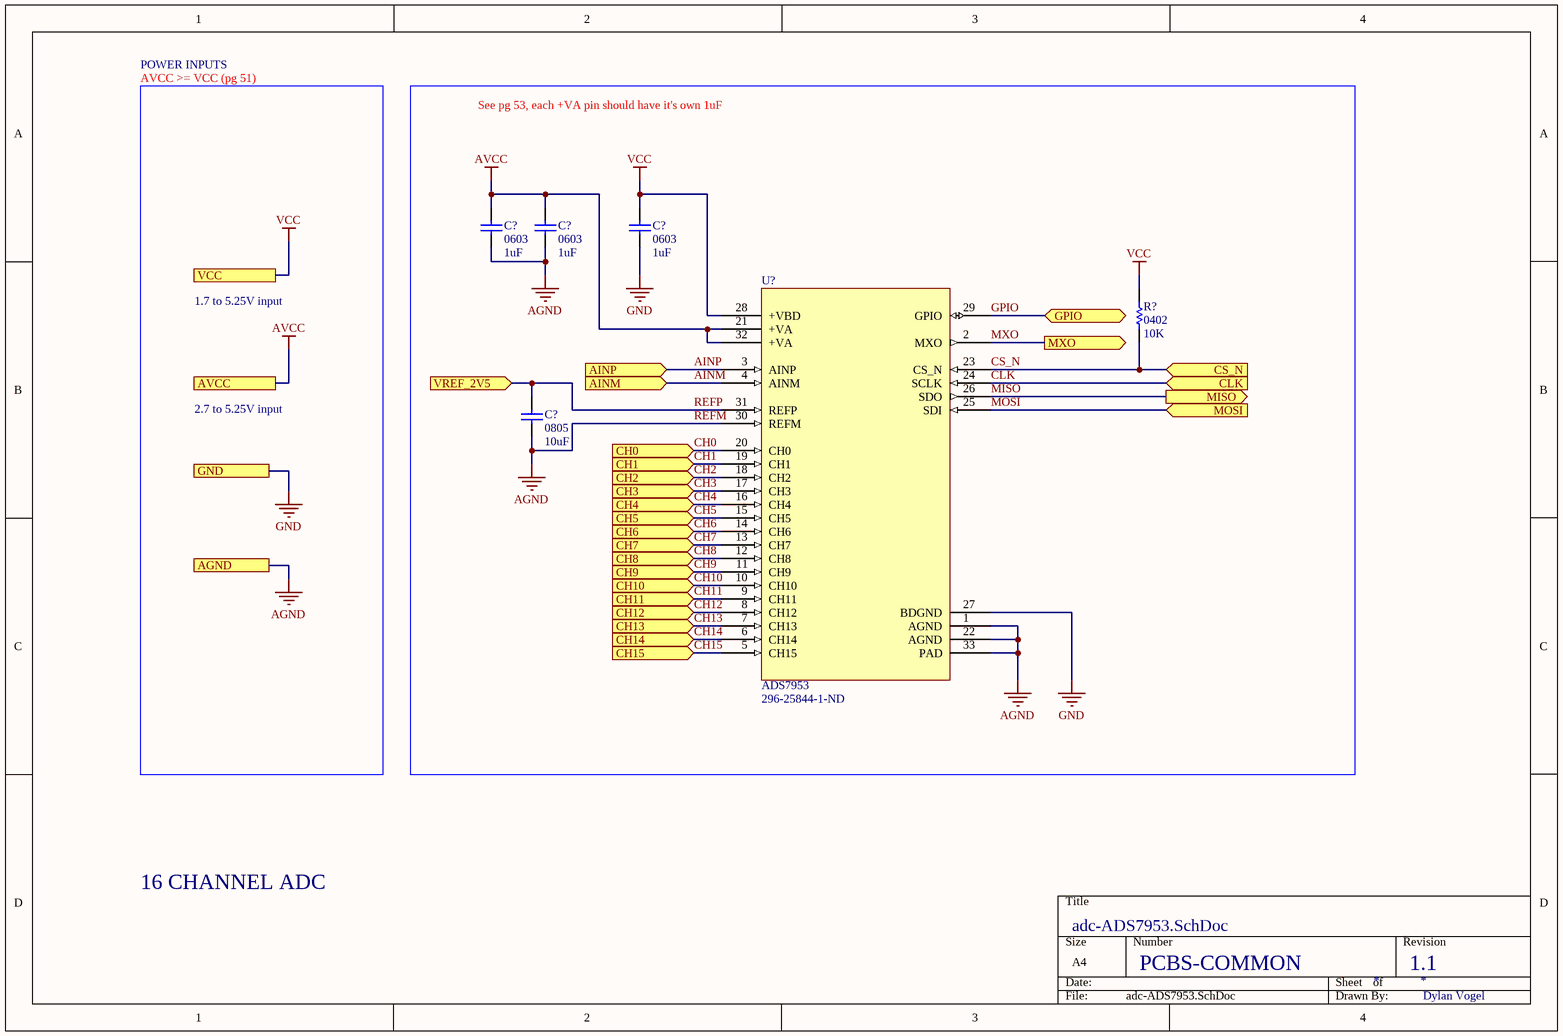
[diagram p4: adc-ADS7953.SchDoc]

### Parts
(Parts that share a designator on the sheet are numbered #1, #2 ... from top to bottom, then left to right.)
C?#15  0603  value 1uF  [CAP0603R]
C?#16  0603  value 1uF  [CAP0603R]
C?#17  0603  value 1uF  [CAP0603R]
C?#18  0805  value 10uF  [CAP0805R]
R?#12  0402  value 10K  [RES0402R]
U?#6  ADS7953  Supplier Part Number 1: 296-25844-1-ND  [QFN50P500X500X100-33]

### Blocks framed on the sheet
See pg 53, each +VA pin should have it's own 1uF: C?#15-C?#18 R?#12 U?#6

### Ports
AGND, AINM (in), AINP (in), AVCC, CH0 (in), CH1 (in), CH2 (in), CH3 (in), CH4 (in), CH5 (in), CH6 (in), CH7 (in), CH8 (in), CH9 (in), CH10 (in), CH11 (in), CH12 (in), CH13 (in), CH14 (in), CH15 (in), CLK (in), CS_N (in), GND, GPIO (bidir), MISO (out), MOSI (in), MXO (out), VCC, VREF_2V5 (in)

### Nets
AGND: C?#15.1 C?#16.1 C?#18.1 U?#6.1(AGND) U?#6.22(AGND) U?#6.30(REFM) U?#6.33(PAD) ; port AGND  [also labelled REFM]
AVCC: C?#15.2 C?#16.2 U?#6.21(+VA) U?#6.32(+VA) ; port AVCC
GND: C?#17.1 U?#6.4(AINM) U?#6.27(BDGND) ; port GND, port AINM  [also labelled AINM]
VCC: C?#17.2 R?#12.2 U?#6.28(+VBD) ; port VCC
AINP: U?#6.3(AINP) ; port AINP  [project net ADC_AINP]
CH0: U?#6.20(CH0) ; port CH0  [project net ADC_CH0]
CH1: U?#6.19(CH1) ; port CH1  [project net ADC_CH1]
CH2: U?#6.18(CH2) ; port CH2  [project net ADC_CH2]
CH3: U?#6.17(CH3) ; port CH3  [project net ADC_CH3]
CH4: U?#6.16(CH4) ; port CH4  [project net ADC_CH4]
CH5: U?#6.15(CH5) ; port CH5  [project net ADC_CH5]
CH6: U?#6.14(CH6) ; port CH6  [project net ADC_CH6]
CH7: U?#6.13(CH7) ; port CH7  [project net ADC_CH7]
CH8: U?#6.12(CH8) ; port CH8  [project net ADC_CH8]
CH9: U?#6.11(CH9) ; port CH9  [project net ADC_CH9]
CH10: U?#6.10(CH10) ; port CH10  [project net ADC_CH10]
CH11: U?#6.9(CH11) ; port CH11  [project net ADC_CH11]
CH12: U?#6.8(CH12) ; port CH12  [project net ADC_CH12]
CH13: U?#6.7(CH13) ; port CH13  [project net ADC_CH13]
CH14: U?#6.6(CH14) ; port CH14  [project net ADC_CH14]
CH15: U?#6.5(CH15) ; port CH15  [project net ADC_CH15]
CLK: U?#6.24(SCLK) ; port CLK  [project net SCLK_R]
CS_N: R?#12.1 U?#6.23(CS_N) ; port CS_N  [project net CS_N_R]
GPIO: U?#6.29(GPIO) ; port GPIO
MISO: U?#6.26(SDO) ; port MISO  [project net MISO_R]
MOSI: U?#6.25(SDI) ; port MOSI  [project net MOSI_R]
MXO: U?#6.2(MXO) ; port MXO  [project net ADC_MXO]
REFP: C?#18.2 U?#6.31(REFP) ; port VREF_2V5  [project net VREF_2V5]

### Notes on the sheet
- POWER INPUTS
- AVCC >= VCC (pg 51)
- 1.7 to 5.25V input
- 2.7 to 5.25V input
- 16 CHANNEL ADC
- PCBS-COMMON

### Library data of the parts
C?#15-C?#17 = CAP0603: as C?#6 on sheet adc-ADS7952; Supplier 1: Digi-Key; Supplier Part Number 1: 399-17704-1-ND; Stock 1: 376276; Pricing 1: 1=0.17, 10=0.12, 100=0.0564, 500=0.03952, 1000=0.03273 (USD); Mount: Surface Mount; Case/Package: 0603; Case Code (Imperial): 0603; Case Code (Metric): 1608; Min Operating Temperature: -55°C; Max Operating Temperature: 125°C; Packaging: Cut Tape; Capacitance: 1uF; Ratings: AEC-Q200
C?#18 = CAP0805: as C?#9 on sheet adc-ADS7952; Supplier 1: Digi-Key; Supplier Part Number 1: 490-14361-1-ND; Stock 1: 214938; Pricing 1: 1=0.42, 10=0.29, 100=0.1742, 500=0.13064, 1000=0.11031, 2500=0.10451, 5000=0.0987 (USD); Case/Package: 0805; Min Operating Temperature: -55°C; Max Operating Temperature: 125°C; Capacitance: 10uF; Packaging: Tape and Reel; Length: 2mm; Depth: 1.25mm; Lead Free: Lead Free
R?#12 = RES0402: as R?#6 on sheet adc-ADS7952; Supplier 1: Digi-Key; Supplier Part Number 1: P10.0KLCT-ND; Stock 1: 14350001; Pricing 1: 1=0.1, 10=0.045, 100=0.0183, 1000=0.00823, 2500=0.00715, 5000=0.0059 (USD); Mount: Surface Mount; Case/Package: 0402; Number of Pins: 2; Case Code (Metric): 1005; Case Code (Imperial): 0402; Contact Plating: Tin; Min Operating Temperature: -55°C; Max Operating Temperature: 155°C; Packaging: Tape and Reel; Package Quantity: 1; Composition: Thick Film; Number of Terminations: 2; Termination: SMD/SMT; Military Standard: Not; Max Power Dissipation: 100mW; Voltage Rating (DC): 50V; Features: Automotive AEC-Q200; Length: 1mm; Height: 0.35mm; Width: 0.02inch; Depth: 0.5mm; Radiation Hardening: No; REACH SVHC: No SVHC; Lead Free: Lead Free; ComponentLink1URL: http://industrial.panasonic.com/www-data/pdf/AOA0000/AOA0000CE2.pdf?src-supplier=Future+Electronics; ComponentLink1Description: http://industrial.panasonic.com/www-data/pdf/AOA0000/AOA0000CE2.pdf?src-supplier=Future+Electronics; ComponentLink2URL: http://industrial.panasonic.com/www-data/pdf/AOA0000/AOA0000CE2.pdf?src-supplier=Avnet+Europe; ComponentLink2Description: http://industrial.panasonic.com/www-data/pdf/AOA0000/AOA0000CE2.pdf?src-supplier=Avnet+Europe; ComponentLink3URL: https://industrial.panasonic.com/cdbs/www-data/pdf/RDA0000/DMA0000COL11.pdf?src-supplier=Mouser; ComponentLink3Description: https://industrial.panasonic.com/cdbs/www-data/pdf/RDA0000/DMA0000COL11.pdf?src-supplier=Mouser; ComponentLink4URL: http://www.farnell.com/datasheets/1678782.pdf?src-supplier=Element14; ComponentLink4Description: http://www.farnell.com/datasheets/1678782.pdf?src-supplier=Element14; ComponentLink5URL: http://www.farnell.com/datasheets/1911175.pdf?src-supplier=Farnell; ComponentLink5Description: http://www.farnell.com/datasheets/1911175.pdf?src-supplier=Farnell; ComponentLink6URL: http://www.jameco.com/Jameco/Products/ProdDS/1987020.pdf?src-supplier=Jameco; ComponentLink6Description: http://www.jameco.com/Jameco/Products/ProdDS/1987020.pdf?src-supplier=Jameco; ComponentLink7URL: http://industrial.panasonic.com/www-data/pdf/AOA0000/AOA0000CE2.pdf?src-supplier=Avnet; ComponentLink7Description: http://industrial.panasonic.com/www-data/pdf/AOA0000/AOA0000CE2.pdf?src-supplier=Avnet; ComponentLink8URL: http://www.alliedelec.com/m/d/623f45ff1957d936ff56d46fd1c28cac.pdf?src-supplier=Allied+Electronics; ComponentLink8Description: http://www.alliedelec.com/m/d/623f45ff1957d936ff56d46fd1c28cac.pdf?src-supplier=Allied+Electronics
U?#6 = ADS7953: 12 bit, 16 channel ADC; Supplier 1: Digi-Key

## Sheet can-SN65HVD233.SchDoc: SN65HVD233
size A4; DrawnBy: Dylan Vogel; Organization: UTAT SS; Revision: 1.2
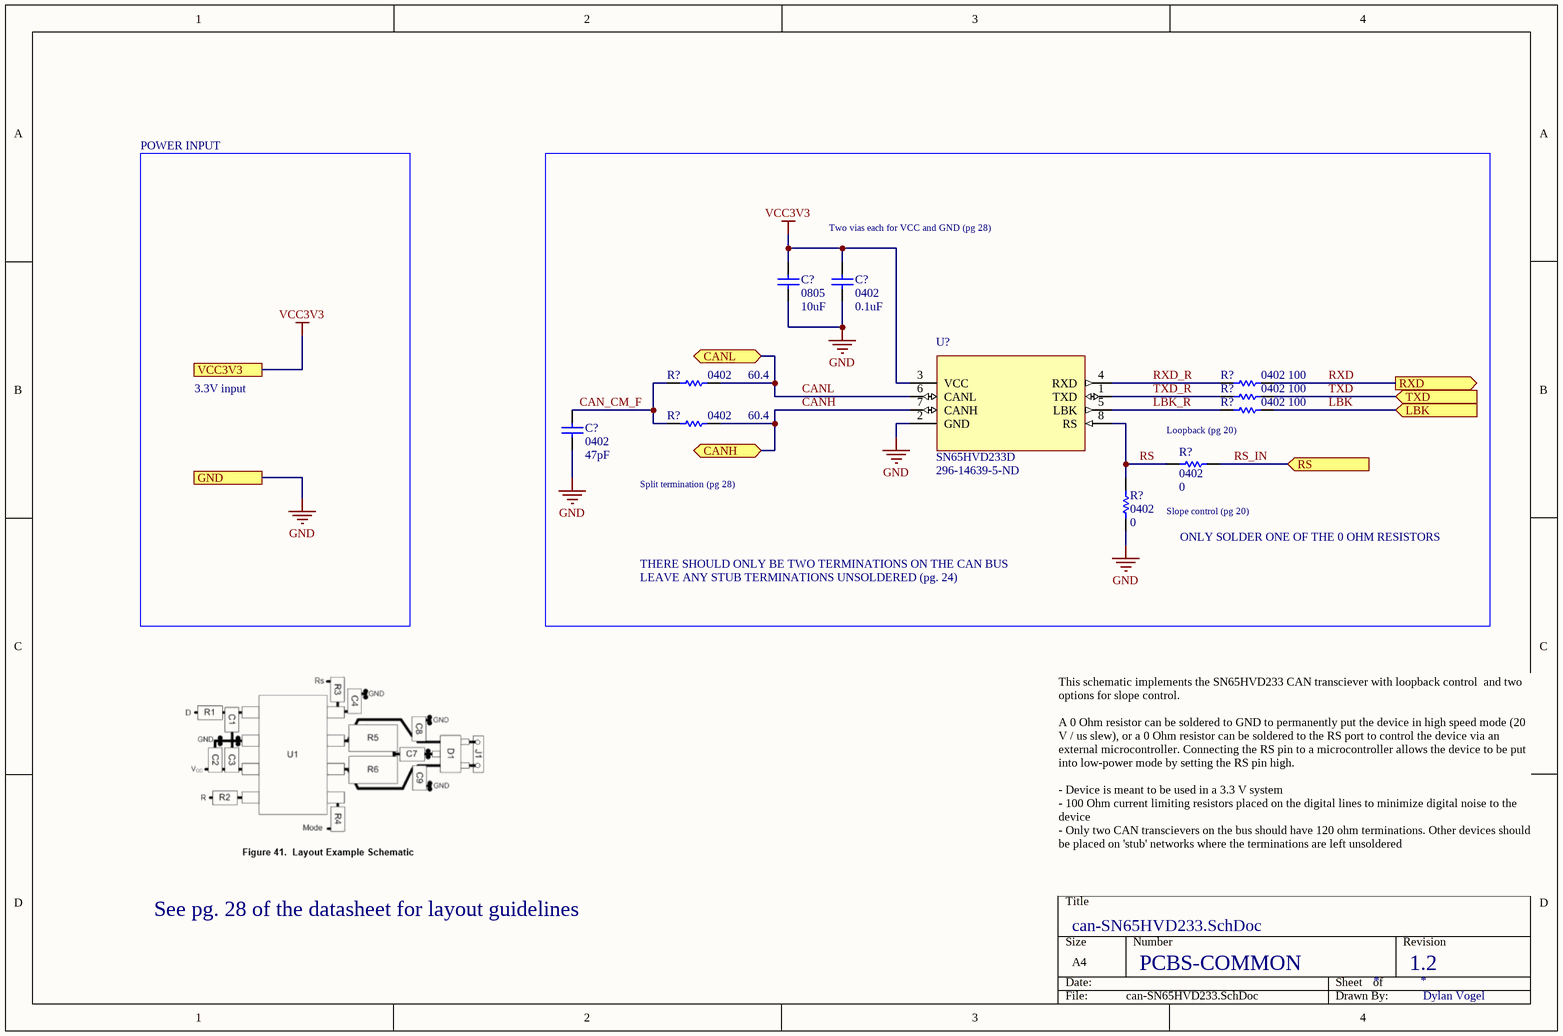
[diagram p5: can-SN65HVD233.SchDoc]

### Parts
(Parts that share a designator on the sheet are numbered #1, #2 ... from top to bottom, then left to right.)
C?#19  0805  value 10uF  [CAP0805R]
C?#20  0402  value 0.1uF  [CAP0402R]
C?#21  0402  value 47pF  [CAP0402R]
R?#13  0402  value 60.4  [RES0402R]
R?#14  0402  value 100  [RES0402R]
R?#15  0402  value 100  [RES0402R]
R?#16  0402  value 100  [RES0402R]
R?#17  0402  value 60.4  [RES0402R]
R?#18  0402  value 0  [RES0402R]
R?#19  0402  value 0  [RES0402R]
U?#7  SN65HVD233D  Supplier Part Number 1: 296-14639-5-ND  [SOIC127P500X600-8N]

### Ports
CANH (bidir), CANL (bidir), GND, LBK (in), RS (in), RXD (out), TXD (in), VCC3V3

### Nets
GND: C?#19.1 C?#20.1 C?#21.1 R?#19.1 U?#7.2(GND) ; port GND
VCC3V3: C?#19.2 C?#20.2 U?#7.3(VCC) ; port VCC3V3  [project net VCC]
CAN_CM_F: C?#21.2 R?#13.1 R?#17.1
CANH: R?#17.2 U?#7.7(CANH) ; port CANH
CANL: R?#13.2 U?#7.6(CANL) ; port CANL
LBK: R?#16.2 ; port LBK
LBK_R: R?#16.1 U?#7.5(LBK)
RS: R?#18.1 R?#19.2 U?#7.8(RS)
RS_IN: R?#18.2 ; port RS
RXD: R?#14.2 ; port RXD
RXD_R: R?#14.1 U?#7.4(RXD)
TXD: R?#15.2 ; port TXD
TXD_R: R?#15.1 U?#7.1(TXD)

### Notes on the sheet
- POWER INPUT
- (near C?#20) Two vias each for VCC and GND (pg 28)
- 3.3V input
- (near R?#16) Loopback (pg 20)
- Split termination (pg 28)
- (near R?#19) Slope control (pg 20)
- THERE SHOULD ONLY BE TWO TERMINATIONS ON THE CAN BUS
- LEAVE ANY STUB TERMINATIONS UNSOLDERED (pg. 24)
- ONLY SOLDER ONE OF THE 0 OHM RESISTORS
- See pg. 28 of the datasheet for layout guidelines
- This schematic implements the SN65HVD233 CAN transciever with loopback control  and two options for slope control.
  A 0 Ohm resistor can be soldered to GND to permanently put the device in high speed mode (20 V / us slew), or a 0 Ohm resistor can be soldered to the RS port to control the device via an external microcontroller. Connecting the RS pin to a microcontroller allows the device to be put into low-power mode by setting the RS pin high.
  - Device is meant to be used in a 3.3 V system
  - 100 Ohm current limiting resistors placed on the digital lines to minimize digital noise to the device
  - Only two CAN transcievers on the bus should have 120 ohm terminations. Other devices should be placed on 'stub' networks where the terminations are left unsoldered
- PCBS-COMMON

### Library data of the parts
C?#19 = CAP0805: as C?#3 on sheet adc-circuit-ADS7952; Supplier 1: Digi-Key; Supplier Part Number 1: 490-14361-1-ND; Stock 1: 214938; Pricing 1: 1=0.42, 10=0.29, 100=0.1742, 500=0.13064, 1000=0.11031, 2500=0.10451, 5000=0.0987 (USD); Case/Package: 0805; Min Operating Temperature: -55°C; Max Operating Temperature: 125°C; Capacitance: 10uF; Packaging: Tape and Reel; Length: 2mm; Depth: 1.25mm; Lead Free: Lead Free
C?#20 = CAP0402: as C?#1 on sheet adc-circuit-ADS7952; Supplier 1: Digi-Key; Supplier Part Number 1: 587-3807-1-ND; Stock 1: 18196; Pricing 1: 1=0.1, 10=0.057, 100=0.0254, 500=0.01812, 1000=0.01423, 2500=0.01294, 5000=0.0119 (USD); Mount: Surface Mount; Case/Package: 0402; Weight: 2.3E-05oz; Case Code (Metric): 1005; Case Code (Imperial): 0402; Min Operating Temperature: -55°C; Max Operating Temperature: 125°C; Package Quantity: 10000; Packaging: Tape and Reel; Termination: SMD/SMT; Voltage Rating (DC): 16V; Length: 0.039inch; Height: 0.5mm; Width: 0.02inch; Thickness: 0.022inch; Ratings: AEC-Q200; Lead Free: Lead Free; Halogen Free: Halogen Free
C?#21 = CAP0402: 0402 capacitor; Manufacturer: KEMET; Manufacturer Part Number: C0402C470J3RACAUTO; Tolerance: 5%; Dielectric: X7R; Supplier 1: Digi-Key; Supplier Part Number 1: 399-17558-1-ND; Stock 1: 18140; Pricing 1: 1=0.15, 10=0.104, 100=0.0489, 500=0.0343, 1000=0.0284, 2500=0.02643, 5000=0.02418 (USD); Case/Package: 0402; Min Operating Temperature: -55°C; Max Operating Temperature: 125°C; Packaging: Tape and Reel; Capacitance: 47pF; Length: 1mm; Depth: 0.5mm
R?#13 R?#17 = RES0402: 0402 resistor; Manufacturer: Vishay; Manufacturer Part Number: CRCW040260R4FKED; Resistance: 60.4R; Power Rating: 63mW; Tolerance: 1%; Voltage Rating: 50V; Temperature Coefficient: 100ppm/°C; Supplier 1: Digi-Key; Supplier Part Number 1: 541-60.4LCT-ND; Stock 1: 132015; Pricing 1: 1=0.1, 10=0.038, 100=0.0154, 1000=0.0069, 2500=0.00599, 5000=0.00495 (USD); Case/Package: 0402; Weight: 2.3E-05oz; Case Code (Imperial): 0402; Case Code (Metric): 1005; Contact Plating: Tin; Min Operating Temperature: -55°C; Max Operating Temperature: 155°C; Packaging: Tape and Reel; Package Quantity: 10; Composition: Thick Film; Number of Terminations: 2; Termination: Solder; Max Power Dissipation: 63mW; Features: Automotive AEC-Q200; Military Standard: Not; Voltage Rating (DC): 50V; Length: 1mm; Height: 0.35mm; Width: 0.5mm; Depth: 0.5mm; Radiation Hardening: No; REACH SVHC: Unknown; Lead Free: Lead Free; ComponentLink1URL: https://www.alliedelec.com/m/d/0c934d6939ccefa68dbe0b96d821c8cf.pdf?src-supplier=Allied+Electronics; ComponentLink1Description: https://www.alliedelec.com/m/d/0c934d6939ccefa68dbe0b96d821c8cf.pdf?src-supplier=Allied+Electronics; ComponentLink2URL: http://www.farnell.com/datasheets/1697337.pdf?src-supplier=Element14; ComponentLink2Description: http://www.farnell.com/datasheets/1697337.pdf?src-supplier=Element14; ComponentLink3URL: http://www.vishay.com/docs/20035/dcrcwe3.pdf?src-supplier=Digi-Key; ComponentLink3Description: http://www.vishay.com/docs/20035/dcrcwe3.pdf?src-supplier=Digi-Key; ComponentLink4URL: http://www.farnell.com/datasheets/2111203.pdf?src-supplier=Element14; ComponentLink4Description: http://www.farnell.com/datasheets/2111203.pdf?src-supplier=Element14; ComponentLink5URL: http://www.vishay.com/docs/20035/dcrcwe3.pdf?src-supplier=Future+Electronics; ComponentLink5Description: http://www.vishay.com/docs/20035/dcrcwe3.pdf?src-supplier=Future+Electronics
R?#14-R?#16 = RES0402: as R?#1 on sheet adc-circuit-ADS7952; Supplier 1: Digi-Key; Supplier Part Number 1: 541-100YCT-ND; Stock 1: 530594; Pricing 1: 1=0.15, 10=0.138, 100=0.0532, 1000=0.02343, 2500=0.02023, 5000=0.0181 (USD); Mount: Surface Mount; Case/Package: 0402; Weight: 2.3E-05oz; Case Code (Imperial): 0402; Case Code (Metric): 1005; Contact Plating: Tin; Min Operating Temperature: -55°C; Max Operating Temperature: 155°C; Packaging: Tape and Reel; Package Quantity: 10000; Termination: SMD/SMT; Composition: Thick Film; Voltage Rating (DC): 50V; Length: 1mm; Height: 0.3mm; Width: 0.5mm; Depth: 0.5mm; Radiation Hardening: No; REACH SVHC: Unknown; Lead Free: Lead Free; ComponentLink1URL: http://www.vishay.com/docs/20043/crcwhpe3.pdf?src-supplier=Avnet; ComponentLink1Description: http://www.vishay.com/docs/20043/crcwhpe3.pdf?src-supplier=Avnet
R?#18 R?#19 = RES0402: 0402 resistor; Manufacturer: Panasonic; Manufacturer Part Number: ERJ-2GE0R00X; Resistance: 0mR; Power Rating: 100mW; Voltage Rating: 50V; Tolerance: 5%; Temperature Coefficient: 600ppm/°C; Supplier 1: Digi-Key; Supplier Part Number 1: P0.0JCT-ND; Stock 1: 47740000; Pricing 1: 1=0.1, 10=0.03, 25=0.0216, 50=0.0164, 100=0.0121, 250=0.00924, 500=0.0074, 1000=0.00545, 5000=0.00391 (USD); Mount: Surface Mount; Case/Package: 0402; Case Code (Metric): 1005; Case Code (Imperial): 0402; Contact Plating: Tin; Min Operating Temperature: -55°C; Max Operating Temperature: 155°C; Packaging: Tape and Reel; Package Quantity: 1; Composition: Thick Film; Number of Terminations: 2; Termination: SMD/SMT; Military Standard: Not; Max Power Dissipation: 100mW; Voltage Rating (DC): 50V; Features: Automotive AEC-Q200; Length: 1mm; Height: 0.35mm; Width: 0.02inch; Depth: 0.5mm; Radiation Hardening: No; REACH SVHC: No SVHC; Lead Free: Lead Free; ComponentLink1URL: http://industrial.panasonic.com/www-data/pdf/AOA0000/AOA0000CE1.pdf?src-supplier=Avnet; ComponentLink1Description: http://industrial.panasonic.com/www-data/pdf/AOA0000/AOA0000CE1.pdf?src-supplier=Avnet; ComponentLink2URL: http://www.alliedelec.com/m/d/51cd0790071e1666bdb9d00c57fcf960.pdf?src-supplier=Allied+Electronics; ComponentLink2Description: http://www.alliedelec.com/m/d/51cd0790071e1666bdb9d00c57fcf960.pdf?src-supplier=Allied+Electronics; ComponentLink3URL: http://industrial.panasonic.com/www-data/pdf/AOA0000/AOA0000CE1.pdf?src-supplier=Avnet+Europe; ComponentLink3Description: http://industrial.panasonic.com/www-data/pdf/AOA0000/AOA0000CE1.pdf?src-supplier=Avnet+Europe; ComponentLink4URL: http://www.farnell.com/datasheets/2059623.pdf?src-supplier=Farnell; ComponentLink4Description: http://www.farnell.com/datasheets/2059623.pdf?src-supplier=Farnell; ComponentLink5URL: http://www.farnell.com/datasheets/2059623.pdf?src-supplier=Element14; ComponentLink5Description: http://www.farnell.com/datasheets/2059623.pdf?src-supplier=Element14; ComponentLink6URL: http://www.farnell.com/datasheets/1678796.pdf?src-supplier=Element14; ComponentLink6Description: http://www.farnell.com/datasheets/1678796.pdf?src-supplier=Element14
U?#7 = SN65HVD233D: 3.3V CAN Transceiver with Standby Mode, Loop-back 8-SOIC -40 to 125; MF: Texas Instruments; MP: SN65HVD233D; Package: SOIC-8 Texas Instruments; Availability: Good; SnapEDA_Link: https://www.snapeda.com/parts/SN65HVD233D/Texas%20Instruments/view-part/?ref=snap; Price: 2.39 USD; Value: *; Supplier 1: Digi-Key

## Sheet dac-DAC7562.SchDoc: DAC7562
size A4; DrawnBy: Dylan Vogel; Organization: UTAT SS; Revision: 1.1
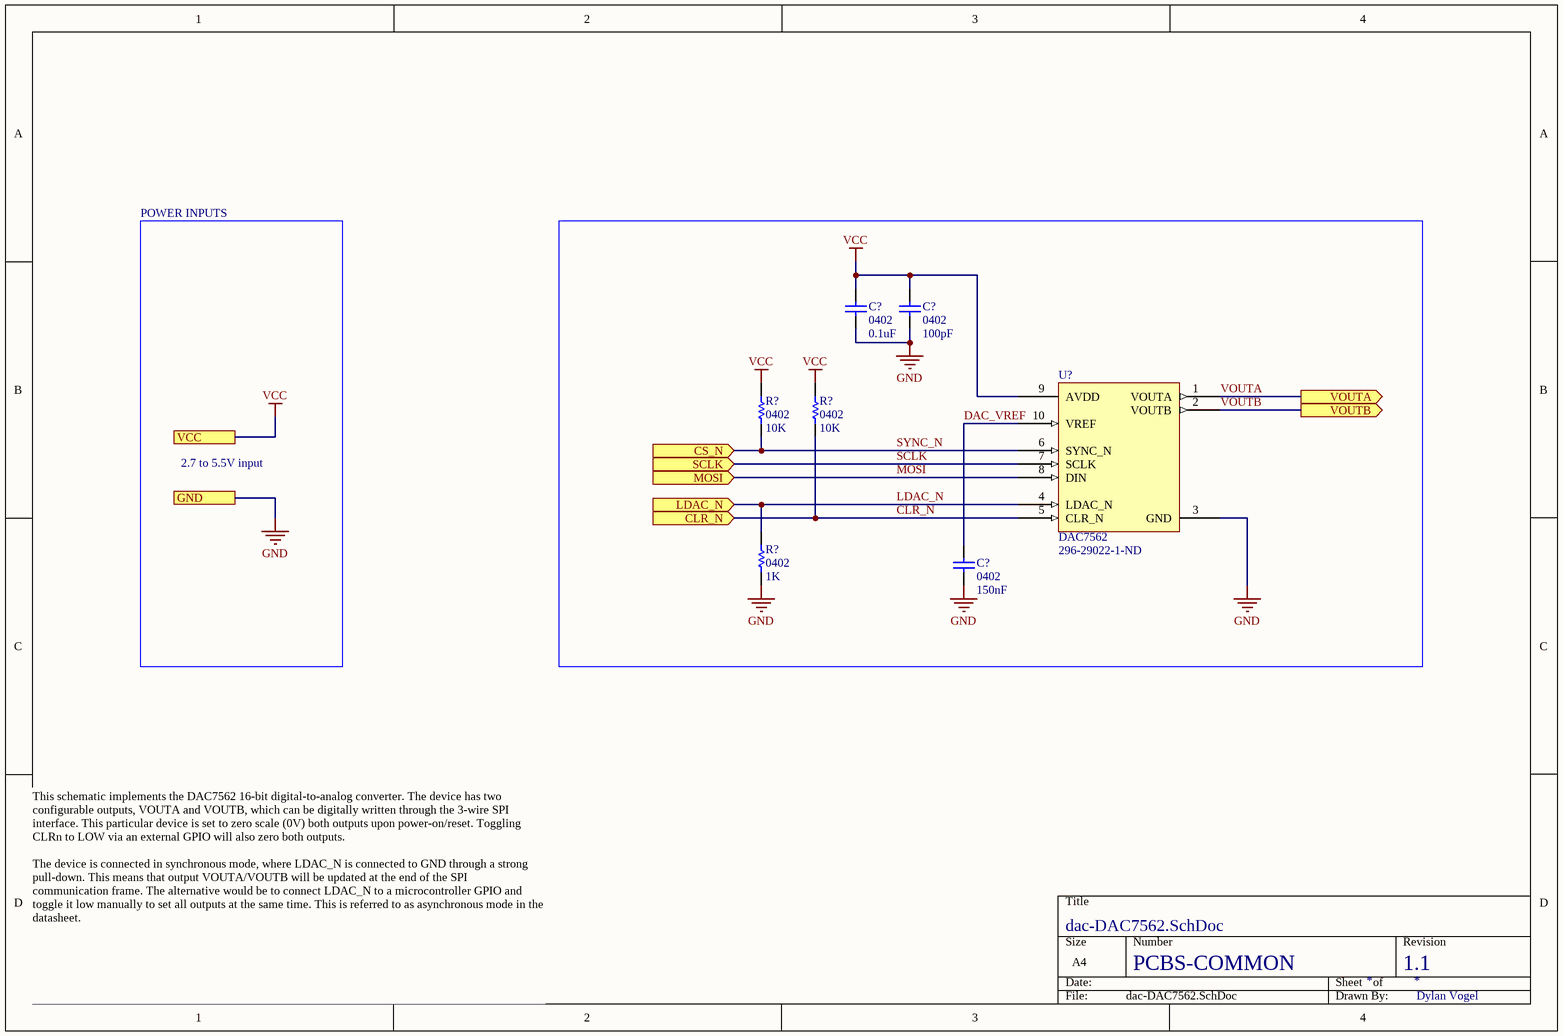
[diagram p6: dac-DAC7562.SchDoc]

### Parts
(Parts that share a designator on the sheet are numbered #1, #2 ... from top to bottom, then left to right.)
C?#22  0402  value 0.1uF  [CAP0402R]
C?#23  0402  value 100pF  [CAP0402R]
C?#24  0402  value 150nF  [CAP0402R]
R?#20  0402  value 10K  [RES0402R]
R?#21  0402  value 10K  [RES0402R]
R?#22  0402  value 1K  [RES0402R]
U?#8  DAC7562  Supplier Part Number 1: 296-29022-1-ND  [SSOP50P300X300-10N]

### Ports
CLR_N (in), CS_N (in), GND, LDAC_N (in), MOSI (in), SCLK (in), VCC, VOUTA (out), VOUTB (out)

### Nets
GND: C?#22.1 C?#23.1 C?#24.1 R?#22.1 U?#8.3(GND) ; port GND
VCC: C?#22.2 C?#23.2 R?#20.2 R?#21.2 U?#8.9(AVDD) ; port VCC
CLR_N: R?#21.1 U?#8.5(CLR_N) ; port CLR_N
DAC_VREF: C?#24.2 U?#8.10(VREF)
LDAC_N: R?#22.2 U?#8.4(LDAC_N) ; port LDAC_N
MOSI: U?#8.8(DIN) ; port MOSI
SCLK: U?#8.7(SCLK) ; port SCLK
SYNC_N: R?#20.1 U?#8.6(SYNC_N) ; port CS_N
VOUTA: U?#8.1(VOUTA) ; port VOUTA
VOUTB: U?#8.2(VOUTB) ; port VOUTB

### Notes on the sheet
- POWER INPUTS
- 2.7 to 5.5V input
- PCBS-COMMON
- This schematic implements the DAC7562 16-bit digital-to-analog converter. The device has two configurable outputs, VOUTA and VOUTB, which can be digitally written through the 3-wire SPI interface. This particular device is set to zero scale (0V) both outputs upon power-on/reset. Toggling CLRn to LOW via an external GPIO will also zero both outputs.
  The device is connected in synchronous mode, where LDAC_N is connected to GND through a strong pull-down. This means that output VOUTA/VOUTB will be updated at the end of the SPI communication frame. The alternative would be to connect LDAC_N to a microcontroller GPIO and toggle it low manually to set all outputs at the same time. This is referred to as asynchronous mode in the datasheet.

### Library data of the parts
C?#22 = CAP0402: as C?#10 on sheet adc-circuit-ADS7953; Supplier 1: Digi-Key; Supplier Part Number 1: 587-3807-1-ND; Stock 1: 18196; Pricing 1: 1=0.1, 10=0.057, 100=0.0254, 500=0.01812, 1000=0.01423, 2500=0.01294, 5000=0.0119 (USD); Mount: Surface Mount; Case/Package: 0402; Weight: 2.3E-05oz; Case Code (Metric): 1005; Case Code (Imperial): 0402; Min Operating Temperature: -55°C; Max Operating Temperature: 125°C; Package Quantity: 10000; Packaging: Tape and Reel; Termination: SMD/SMT; Voltage Rating (DC): 16V; Length: 0.039inch; Height: 0.5mm; Width: 0.02inch; Thickness: 0.022inch; Ratings: AEC-Q200; Lead Free: Lead Free; Halogen Free: Halogen Free
C?#23 = CAP0402: 0402 capacitor; Manufacturer: KEMET; Manufacturer Part Number: C0402C101J5RACAUTO; Description: CAP CER SMD 0402 100PF 5% X7R 50; Dielectric Material: Ceramic; Voltage Rating (DC): 50V; Dielectric: X7R; Tolerance: 5%; Supplier 1: Digi-Key; Supplier Part Number 1: 399-17545-1-ND; Stock 1: 193150; Pricing 1: 1=0.13, 10=0.092, 100=0.0409, 500=0.02918, 1000=0.02293, 2500=0.02084, 5000=0.01918 (USD); Case/Package: 0402; Capacitance: 100pF
C?#24 = CAP0402: 0402 capacitor; Manufacturer: TDK; Manufacturer Part Number: CGA2B1X7R1A154M050BC; Description: CAP CER 0.15UF 10V X7R 0402; Tolerance: 20%; Voltage Rating: 10V; Dielectric: X7R; Supplier 1: Digi-Key; Supplier Part Number 1: 445-12236-1-ND; Stock 1: 9983; Pricing 1: 1=0.15, 10=0.106, 100=0.05, 500=0.03508, 1000=0.02904, 2500=0.02702, 5000=0.02473 (USD); Mount: Surface Mount; Case/Package: 0402; Weight: 2.3E-05oz; Case Code (Metric): 1005; Case Code (Imperial): 0402; Min Operating Temperature: -55°C; Max Operating Temperature: 125°C; Package Quantity: 10000; Packaging: Tape and Reel; Capacitance: 150nF; Voltage Rating (DC): 10V; Length: 0.039inch; Height: 0.5mm; Width: 0.5mm; Thickness: 0.022inch; Ratings: AEC-Q200
R?#20 R?#21 = RES0402: as R?#6 on sheet adc-ADS7952; Supplier 1: Digi-Key; Supplier Part Number 1: P10.0KLCT-ND; Stock 1: 14350001; Pricing 1: 1=0.1, 10=0.045, 100=0.0183, 1000=0.00823, 2500=0.00715, 5000=0.0059 (USD); Mount: Surface Mount; Case/Package: 0402; Number of Pins: 2; Case Code (Metric): 1005; Case Code (Imperial): 0402; Contact Plating: Tin; Min Operating Temperature: -55°C; Max Operating Temperature: 155°C; Packaging: Tape and Reel; Package Quantity: 1; Composition: Thick Film; Number of Terminations: 2; Termination: SMD/SMT; Military Standard: Not; Max Power Dissipation: 100mW; Voltage Rating (DC): 50V; Features: Automotive AEC-Q200; Length: 1mm; Height: 0.35mm; Width: 0.02inch; Depth: 0.5mm; Radiation Hardening: No; REACH SVHC: No SVHC; Lead Free: Lead Free; ComponentLink1URL: http://industrial.panasonic.com/www-data/pdf/AOA0000/AOA0000CE2.pdf?src-supplier=Future+Electronics; ComponentLink1Description: http://industrial.panasonic.com/www-data/pdf/AOA0000/AOA0000CE2.pdf?src-supplier=Future+Electronics; ComponentLink2URL: http://industrial.panasonic.com/www-data/pdf/AOA0000/AOA0000CE2.pdf?src-supplier=Avnet+Europe; ComponentLink2Description: http://industrial.panasonic.com/www-data/pdf/AOA0000/AOA0000CE2.pdf?src-supplier=Avnet+Europe; ComponentLink3URL: https://industrial.panasonic.com/cdbs/www-data/pdf/RDA0000/DMA0000COL11.pdf?src-supplier=Mouser; ComponentLink3Description: https://industrial.panasonic.com/cdbs/www-data/pdf/RDA0000/DMA0000COL11.pdf?src-supplier=Mouser; ComponentLink4URL: http://www.farnell.com/datasheets/1678782.pdf?src-supplier=Element14; ComponentLink4Description: http://www.farnell.com/datasheets/1678782.pdf?src-supplier=Element14; ComponentLink5URL: http://www.farnell.com/datasheets/1911175.pdf?src-supplier=Farnell; ComponentLink5Description: http://www.farnell.com/datasheets/1911175.pdf?src-supplier=Farnell; ComponentLink6URL: http://www.jameco.com/Jameco/Products/ProdDS/1987020.pdf?src-supplier=Jameco; ComponentLink6Description: http://www.jameco.com/Jameco/Products/ProdDS/1987020.pdf?src-supplier=Jameco; ComponentLink7URL: http://industrial.panasonic.com/www-data/pdf/AOA0000/AOA0000CE2.pdf?src-supplier=Avnet; ComponentLink7Description: http://industrial.panasonic.com/www-data/pdf/AOA0000/AOA0000CE2.pdf?src-supplier=Avnet; ComponentLink8URL: http://www.alliedelec.com/m/d/623f45ff1957d936ff56d46fd1c28cac.pdf?src-supplier=Allied+Electronics; ComponentLink8Description: http://www.alliedelec.com/m/d/623f45ff1957d936ff56d46fd1c28cac.pdf?src-supplier=Allied+Electronics
R?#22 = RES0402: 0402 resistor; Manufacturer: Panasonic; Manufacturer Part Number: ERJ-PA2J102X; Description: RES SMD 1K OHM 5% 1/5W 0402; Resistance: 1kR; Tolerance: 5%; Max Power Dissipation: 200mW; Temperature Coefficient: 200ppm/°C; Supplier 1: Digi-Key; Supplier Part Number 1: P17193CT-ND; Stock 1: 7229; Pricing 1: 1=0.16, 10=0.133, 100=0.0518, 1000=0.0217, 2500=0.0199, 5000=0.01809 (USD); Case/Package: 0402; Case Code (Metric): 1005; Case Code (Imperial): 0402; Min Operating Temperature: -55°C; Max Operating Temperature: 155°C; Packaging: Tape and Reel; Composition: Thick Film; Number of Terminations: 2; Features: Automotive AEC-Q200; Length: 0.039inch; Height: 0.016inch; Width: 0.02inch
U?#8 = DAC7562: 12-bit, low-power, voltage-output DAC with internal reference.; Supplier 1: Digi-Key